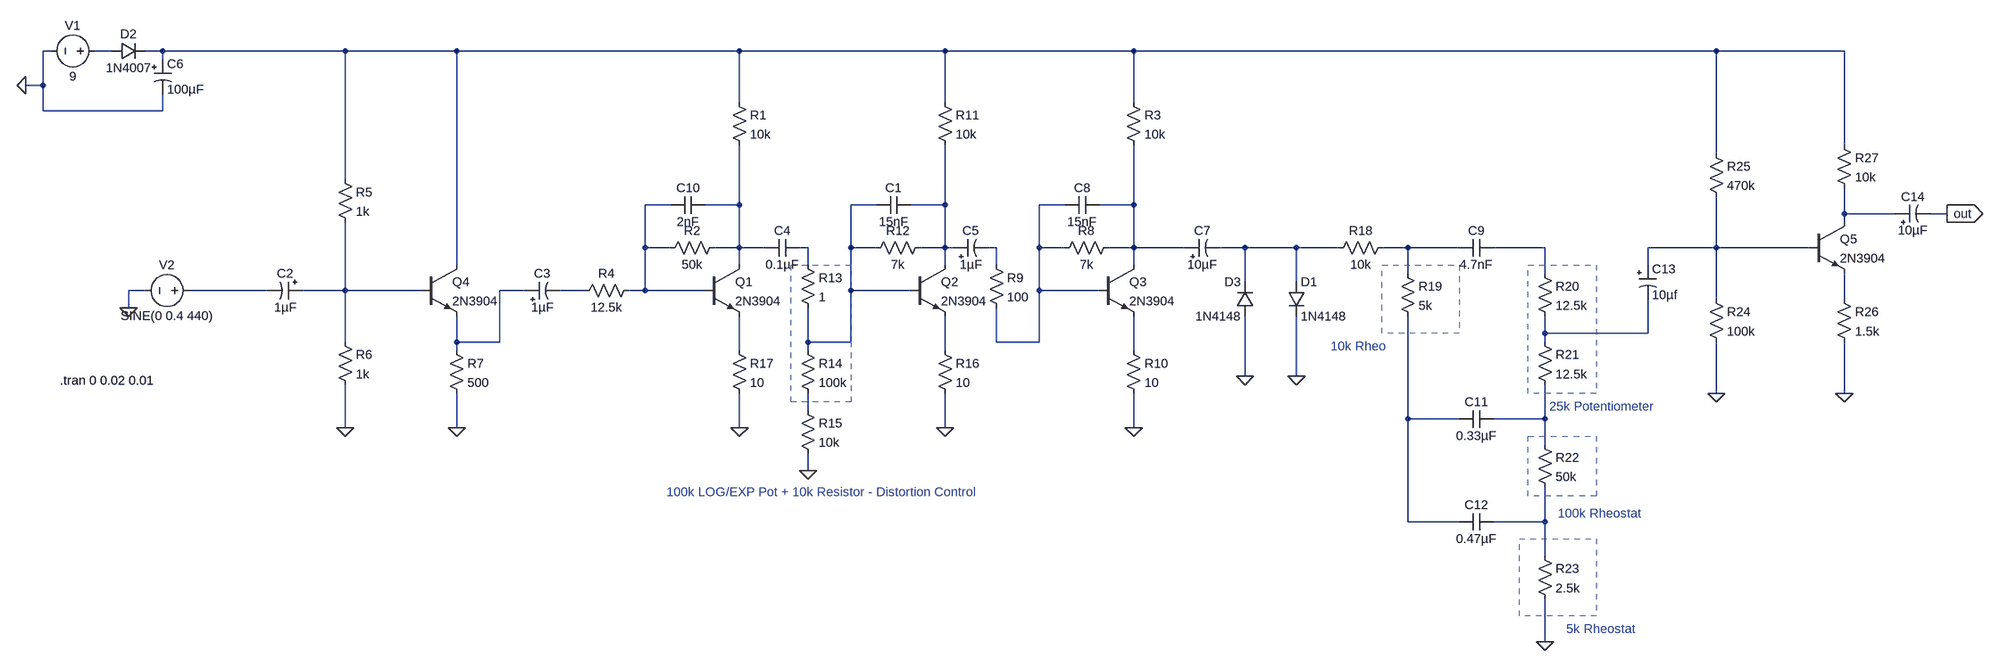
[diagram p0: schematic trantest_5.asc]
trantest_5.asc, the LTspice schematic file:
Version 4
SHEET 1 3424 1060
WIRE -448 -272 -464 -272
WIRE -336 -272 -368 -272
WIRE -240 -272 -272 -272
WIRE 144 -272 -240 -272
WIRE 352 -272 144 -272
WIRE 880 -272 352 -272
WIRE 1264 -272 880 -272
WIRE 1616 -272 1264 -272
WIRE 2704 -272 1616 -272
WIRE 2976 -272 2704 -272
WIRE -240 -256 -240 -272
WIRE -464 -208 -464 -272
WIRE -464 -208 -496 -208
WIRE 880 -176 880 -272
WIRE 1264 -176 1264 -272
WIRE 1616 -176 1616 -272
WIRE -464 -160 -464 -208
WIRE -240 -160 -240 -192
WIRE -240 -160 -464 -160
WIRE 2976 -96 2976 -272
WIRE 2704 -80 2704 -272
WIRE 144 -32 144 -272
WIRE 752 16 704 16
WIRE 880 16 880 -96
WIRE 880 16 816 16
WIRE 1136 16 1088 16
WIRE 1264 16 1264 -96
WIRE 1264 16 1200 16
WIRE 1488 16 1440 16
WIRE 1616 16 1616 -96
WIRE 1616 16 1552 16
WIRE 2976 32 2976 -16
WIRE 3072 32 2976 32
WIRE 3168 32 3136 32
WIRE 2976 48 2976 32
WIRE 704 96 704 16
WIRE 752 96 704 96
WIRE 880 96 880 16
WIRE 880 96 832 96
WIRE 928 96 880 96
WIRE 1008 96 992 96
WIRE 1088 96 1088 16
WIRE 1136 96 1088 96
WIRE 1264 96 1264 16
WIRE 1264 96 1216 96
WIRE 1280 96 1264 96
WIRE 1360 96 1344 96
WIRE 1440 96 1440 16
WIRE 1488 96 1440 96
WIRE 1616 96 1616 16
WIRE 1616 96 1568 96
WIRE 1712 96 1616 96
WIRE 1824 96 1776 96
WIRE 1920 96 1824 96
WIRE 2000 96 1920 96
WIRE 2128 96 2080 96
WIRE 2224 96 2128 96
WIRE 2384 96 2288 96
WIRE 2704 96 2704 0
WIRE 2704 96 2576 96
WIRE 2912 96 2704 96
WIRE 352 128 352 -272
WIRE 880 128 880 96
WIRE 1008 128 1008 96
WIRE 1264 128 1264 96
WIRE 1360 128 1360 96
WIRE 1616 128 1616 96
WIRE 2576 128 2576 96
WIRE 2128 144 2128 96
WIRE 2384 144 2384 96
WIRE 1824 160 1824 96
WIRE 1920 160 1920 96
WIRE -272 176 -304 176
WIRE 0 176 -192 176
WIRE 144 176 144 48
WIRE 144 176 64 176
WIRE 288 176 144 176
WIRE 480 176 432 176
WIRE 592 176 544 176
WIRE 704 176 704 96
WIRE 704 176 672 176
WIRE 816 176 704 176
WIRE 1088 176 1088 96
WIRE 1200 176 1088 176
WIRE 1440 176 1440 96
WIRE 1552 176 1440 176
WIRE 2704 192 2704 96
WIRE 2976 192 2976 144
WIRE -304 208 -304 176
WIRE 2384 256 2384 224
WIRE 2576 256 2576 192
WIRE 2576 256 2384 256
WIRE 144 272 144 176
WIRE 352 272 352 224
WIRE 432 272 432 176
WIRE 432 272 352 272
WIRE 1008 272 1008 208
WIRE 1088 272 1088 176
WIRE 1088 272 1008 272
WIRE 1360 272 1360 208
WIRE 1440 272 1440 176
WIRE 1440 272 1360 272
WIRE 2384 272 2384 256
WIRE 352 288 352 272
WIRE 880 288 880 224
WIRE 1008 288 1008 272
WIRE 1264 288 1264 224
WIRE 1616 288 1616 224
WIRE 1824 336 1824 224
WIRE 1920 336 1920 224
WIRE 2704 368 2704 272
WIRE 2976 368 2976 272
WIRE 1008 400 1008 368
WIRE 2128 416 2128 224
WIRE 2224 416 2128 416
WIRE 2384 416 2384 352
WIRE 2384 416 2288 416
WIRE 144 432 144 352
WIRE 352 432 352 368
WIRE 880 432 880 368
WIRE 1264 432 1264 368
WIRE 1616 432 1616 368
WIRE 2384 464 2384 416
WIRE 1008 512 1008 480
WIRE 2128 608 2128 416
WIRE 2224 608 2128 608
WIRE 2384 608 2384 544
WIRE 2384 608 2288 608
WIRE 2384 672 2384 608
WIRE 2384 832 2384 752
FLAG -496 -208 0
FLAG -304 208 0
FLAG 1008 512 0
FLAG 1920 336 0
FLAG 1824 336 0
FLAG 880 432 0
FLAG 1264 432 0
FLAG 1616 432 0
FLAG 2384 832 0
FLAG 144 432 0
FLAG 352 432 0
FLAG 2704 368 0
FLAG 2976 368 0
FLAG 3168 32 out
IOPIN 3168 32 Out
SYMBOL npn 816 128 R0
SYMATTR InstName Q1
SYMATTR Value 2N3904
SYMBOL res 864 -192 R0
SYMATTR InstName R1
SYMATTR Value 10k
SYMBOL res 688 160 R90
WINDOW 0 0 56 VBottom 2
WINDOW 3 32 56 VTop 2
SYMATTR InstName R4
SYMATTR Value 12.5k
SYMBOL cap 992 80 R90
WINDOW 0 0 32 VBottom 2
WINDOW 3 32 32 VTop 2
SYMATTR InstName C4
SYMATTR Value 0.1µF
SYMBOL voltage -352 -272 R90
WINDOW 0 -32 56 VBottom 2
WINDOW 3 32 56 VTop 2
WINDOW 123 0 0 Left 0
WINDOW 39 0 0 Left 0
SYMATTR InstName V1
SYMATTR Value 9
SYMBOL diode -336 -256 R270
WINDOW 0 32 32 VTop 2
WINDOW 3 0 32 VBottom 2
SYMATTR InstName D2
SYMATTR Value 1N4007
SYMBOL polcap -256 -256 R0
SYMATTR InstName C6
SYMATTR Value 100µF
SYMBOL voltage -176 176 R90
WINDOW 0 -32 56 VBottom 2
WINDOW 3 32 56 VTop 2
WINDOW 123 0 0 Left 0
WINDOW 39 60 56 VTop 2
SYMATTR InstName V2
SYMATTR Value SINE(0 0.4 440)
SYMBOL res 848 80 R90
WINDOW 0 0 56 VBottom 2
WINDOW 3 32 56 VTop 2
SYMATTR InstName R2
SYMATTR Value 50k
SYMBOL cap 816 0 R90
WINDOW 0 0 32 VBottom 2
WINDOW 3 32 32 VTop 2
SYMATTR InstName C10
SYMATTR Value 2nF
SYMBOL npn 1200 128 R0
SYMATTR InstName Q2
SYMATTR Value 2N3904
SYMBOL res 1248 -192 R0
SYMATTR InstName R11
SYMATTR Value 10k
SYMBOL res 1232 80 R90
WINDOW 0 0 56 VBottom 2
WINDOW 3 32 56 VTop 2
SYMATTR InstName R12
SYMATTR Value 7k
SYMBOL res 992 272 R0
SYMATTR InstName R14
SYMATTR Value 100k
SYMBOL res 992 384 R0
SYMATTR InstName R15
SYMATTR Value 10k
SYMBOL res 992 112 R0
SYMATTR InstName R13
SYMATTR Value 1
SYMBOL diode 1904 160 R0
SYMATTR InstName D1
SYMATTR Value 1N4148
SYMBOL diode 1840 224 R180
WINDOW 0 24 64 Left 2
WINDOW 3 24 0 Left 2
SYMATTR InstName D3
SYMATTR Value 1N4148
SYMBOL npn 1552 128 R0
SYMATTR InstName Q3
SYMATTR Value 2N3904
SYMBOL res 1600 -192 R0
SYMATTR InstName R3
SYMATTR Value 10k
SYMBOL res 1584 80 R90
WINDOW 0 0 56 VBottom 2
WINDOW 3 32 56 VTop 2
SYMATTR InstName R8
SYMATTR Value 7k
SYMBOL res 1344 112 R0
SYMATTR InstName R9
SYMATTR Value 100
SYMBOL res 1600 272 R0
SYMATTR InstName R10
SYMATTR Value 10
SYMBOL res 1248 272 R0
SYMATTR InstName R16
SYMATTR Value 10
SYMBOL res 864 272 R0
SYMATTR InstName R17
SYMATTR Value 10
SYMBOL cap 1200 0 R90
WINDOW 0 0 32 VBottom 2
WINDOW 3 32 32 VTop 2
SYMATTR InstName C1
SYMATTR Value 15nF
SYMBOL cap 1552 0 R90
WINDOW 0 0 32 VBottom 2
WINDOW 3 32 32 VTop 2
SYMATTR InstName C8
SYMATTR Value 15nF
SYMBOL res 2096 80 R90
WINDOW 0 0 56 VBottom 2
WINDOW 3 32 56 VTop 2
SYMATTR InstName R18
SYMATTR Value 10k
SYMBOL res 2112 128 R0
SYMATTR InstName R19
SYMATTR Value 5k
SYMBOL cap 2288 80 R90
WINDOW 0 0 32 VBottom 2
WINDOW 3 32 32 VTop 2
SYMATTR InstName C9
SYMATTR Value 4.7nF
SYMBOL res 2368 128 R0
SYMATTR InstName R20
SYMATTR Value 12.5k
SYMBOL res 2368 256 R0
SYMATTR InstName R21
SYMATTR Value 12.5k
SYMBOL res 2368 448 R0
SYMATTR InstName R22
SYMATTR Value 50k
SYMBOL res 2368 656 R0
SYMATTR InstName R23
SYMATTR Value 2.5k
SYMBOL cap 2288 400 R90
WINDOW 0 0 32 VBottom 2
WINDOW 3 32 32 VTop 2
SYMATTR InstName C11
SYMATTR Value 0.33µF
SYMBOL cap 2288 592 R90
WINDOW 0 0 32 VBottom 2
WINDOW 3 32 32 VTop 2
SYMATTR InstName C12
SYMATTR Value 0.47µF
SYMBOL polcap 64 160 R90
WINDOW 0 0 32 VBottom 2
WINDOW 3 32 32 VTop 2
SYMATTR InstName C2
SYMATTR Value 1µF
SYMBOL polcap 480 192 R270
WINDOW 0 32 32 VTop 2
WINDOW 3 0 32 VBottom 2
SYMATTR InstName C3
SYMATTR Value 1µF
SYMBOL polcap 1280 112 R270
WINDOW 0 32 32 VTop 2
WINDOW 3 0 32 VBottom 2
SYMATTR InstName C5
SYMATTR Value 1µF
SYMBOL polcap 1712 112 R270
WINDOW 0 32 32 VTop 2
WINDOW 3 0 32 VBottom 2
SYMATTR InstName C7
SYMATTR Value 10µF
SYMBOL polcap 2560 128 R0
SYMATTR InstName C13
SYMATTR Value 10µf
SYMBOL npn 288 128 R0
SYMATTR InstName Q4
SYMATTR Value 2N3904
SYMBOL res 128 -48 R0
SYMATTR InstName R5
SYMATTR Value 1k
SYMBOL res 128 256 R0
SYMATTR InstName R6
SYMATTR Value 1k
SYMBOL res 336 272 R0
SYMATTR InstName R7
SYMATTR Value 500
SYMBOL res 2688 176 R0
SYMATTR InstName R24
SYMATTR Value 100k
SYMBOL res 2688 -96 R0
SYMATTR InstName R25
SYMATTR Value 470k
SYMBOL npn 2912 48 R0
SYMATTR InstName Q5
SYMATTR Value 2N3904
SYMBOL res 2960 176 R0
SYMATTR InstName R26
SYMATTR Value 1.5k
SYMBOL res 2960 -112 R0
SYMATTR InstName R27
SYMATTR Value 10k
SYMBOL polcap 3072 48 R270
WINDOW 0 32 32 VTop 2
WINDOW 3 0 32 VBottom 2
SYMATTR InstName C14
SYMATTR Value 10µF
TEXT 744 552 Left 2 ;100k LOG/EXP Pot + 10k Resistor - Distortion Control
TEXT -432 344 Left 2 !.tran 0 0.02 0.01
TEXT 1984 280 Left 2 ;10k Rheo
TEXT 2408 592 Left 2 ;100k Rheostat
TEXT 2424 808 Left 2 ;5k Rheostat
TEXT 2392 392 Left 2 ;25k Potentiometer
RECTANGLE Normal 1088 384 976 128 2
RECTANGLE Normal 2224 256 2080 128 2
RECTANGLE Normal 2480 560 2352 448 2
RECTANGLE Normal 2480 368 2352 128 2
RECTANGLE Normal 2480 784 2336 640 2

The netlist it stands for:
* trantest_5.asc
Q1 N004 N003 N022 0 2N3904
R1 N002 N004 10k
R4 N003 N019 12.5k
C4 N010 N004 0.1µF
V1 N001 0 9
D2 N001 N002 1N4007
C6 N002 0 100µF
V2 N016 0 SINE(0 0.4 440)
R2 N004 N003 50k
C10 N004 N003 2nF
Q2 N006 N005 N023 0 2N3904
R11 N002 N006 10k
R12 N006 N005 7k
R14 N005 N025 100k
R15 N025 0 10k
R13 N010 N005 1
D1 N012 0 1N4148
D3 0 N012 1N4148
Q3 N008 N007 N024 0 2N3904
R3 N002 N008 10k
R8 N008 N007 7k
R9 N011 N007 100
R10 N024 0 10
R16 N023 0 10
R17 N022 0 10
C1 N006 N005 15nF
C8 N008 N007 15nF
R18 N013 N012 10k
R19 N013 N026 5k
C9 N014 N013 4.7nF
R20 N014 N021 12.5k
R21 N021 N027 12.5k
R22 N027 N028 50k
R23 N028 0 2.5k
C11 N027 N026 0.33µF
C12 N028 N026 0.47µF
C2 N017 N016 1µF
C3 N018 N019 1µF
C5 N006 N011 1µF
C7 N008 N012 10µF
C13 N015 N021 10µf
Q4 N002 N017 N018 0 2N3904
R5 N002 N017 1k
R6 N017 0 1k
R7 N018 0 500
R24 N015 0 100k
R25 N002 N015 470k
Q5 N009 N015 N020 0 2N3904
R26 N020 0 1.5k
R27 N002 N009 10k
C14 N009 out 10µF
.model D D
.lib standard.dio
.model NPN NPN
.model PNP PNP
.lib standard.bjt
* 100k LOG/EXP Pot + 10k Resistor - Distortion Control
.tran 0 0.02 0.01
* 10k Rheo
* 100k Rheostat
* 5k Rheostat
* 25k Potentiometer
.backanno
.end